# Altium schematic sheet DB15M.SchDoc
size A4
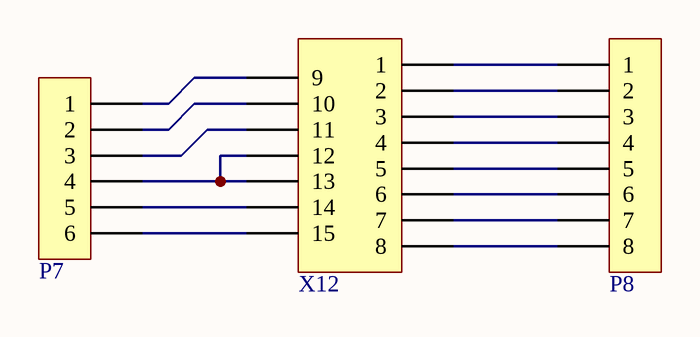
[diagram p0: DB15M.SchDoc]

## Parts
P7  SIL-CONN-6  [SIL-CONN-6-R1]  (value not drawn)
P8  SIL-CONN-8  [SIL-CONN-8-R1]  (value not drawn)
X12  DB-15  [DB15M]  (value not drawn)

## Nets
NetP7_1: P7.1 X12.9
NetP7_2: P7.2 X12.10
NetP7_3: P7.3 X12.11
NetP7_4: P7.4 X12.12 X12.13
NetP7_5: P7.5 X12.14
NetP7_6: P7.6 X12.15
NetP8_1: P8.1 X12.1
NetP8_2: P8.2 X12.2
NetP8_3: P8.3 X12.3
NetP8_4: P8.4 X12.4
NetP8_5: P8.5 X12.5
NetP8_6: P8.6 X12.6
NetP8_7: P8.7 X12.7
NetP8_8: P8.8 X12.8